# EAGLE design MI_LED_Driver_B (EAGLE 6.5.0)
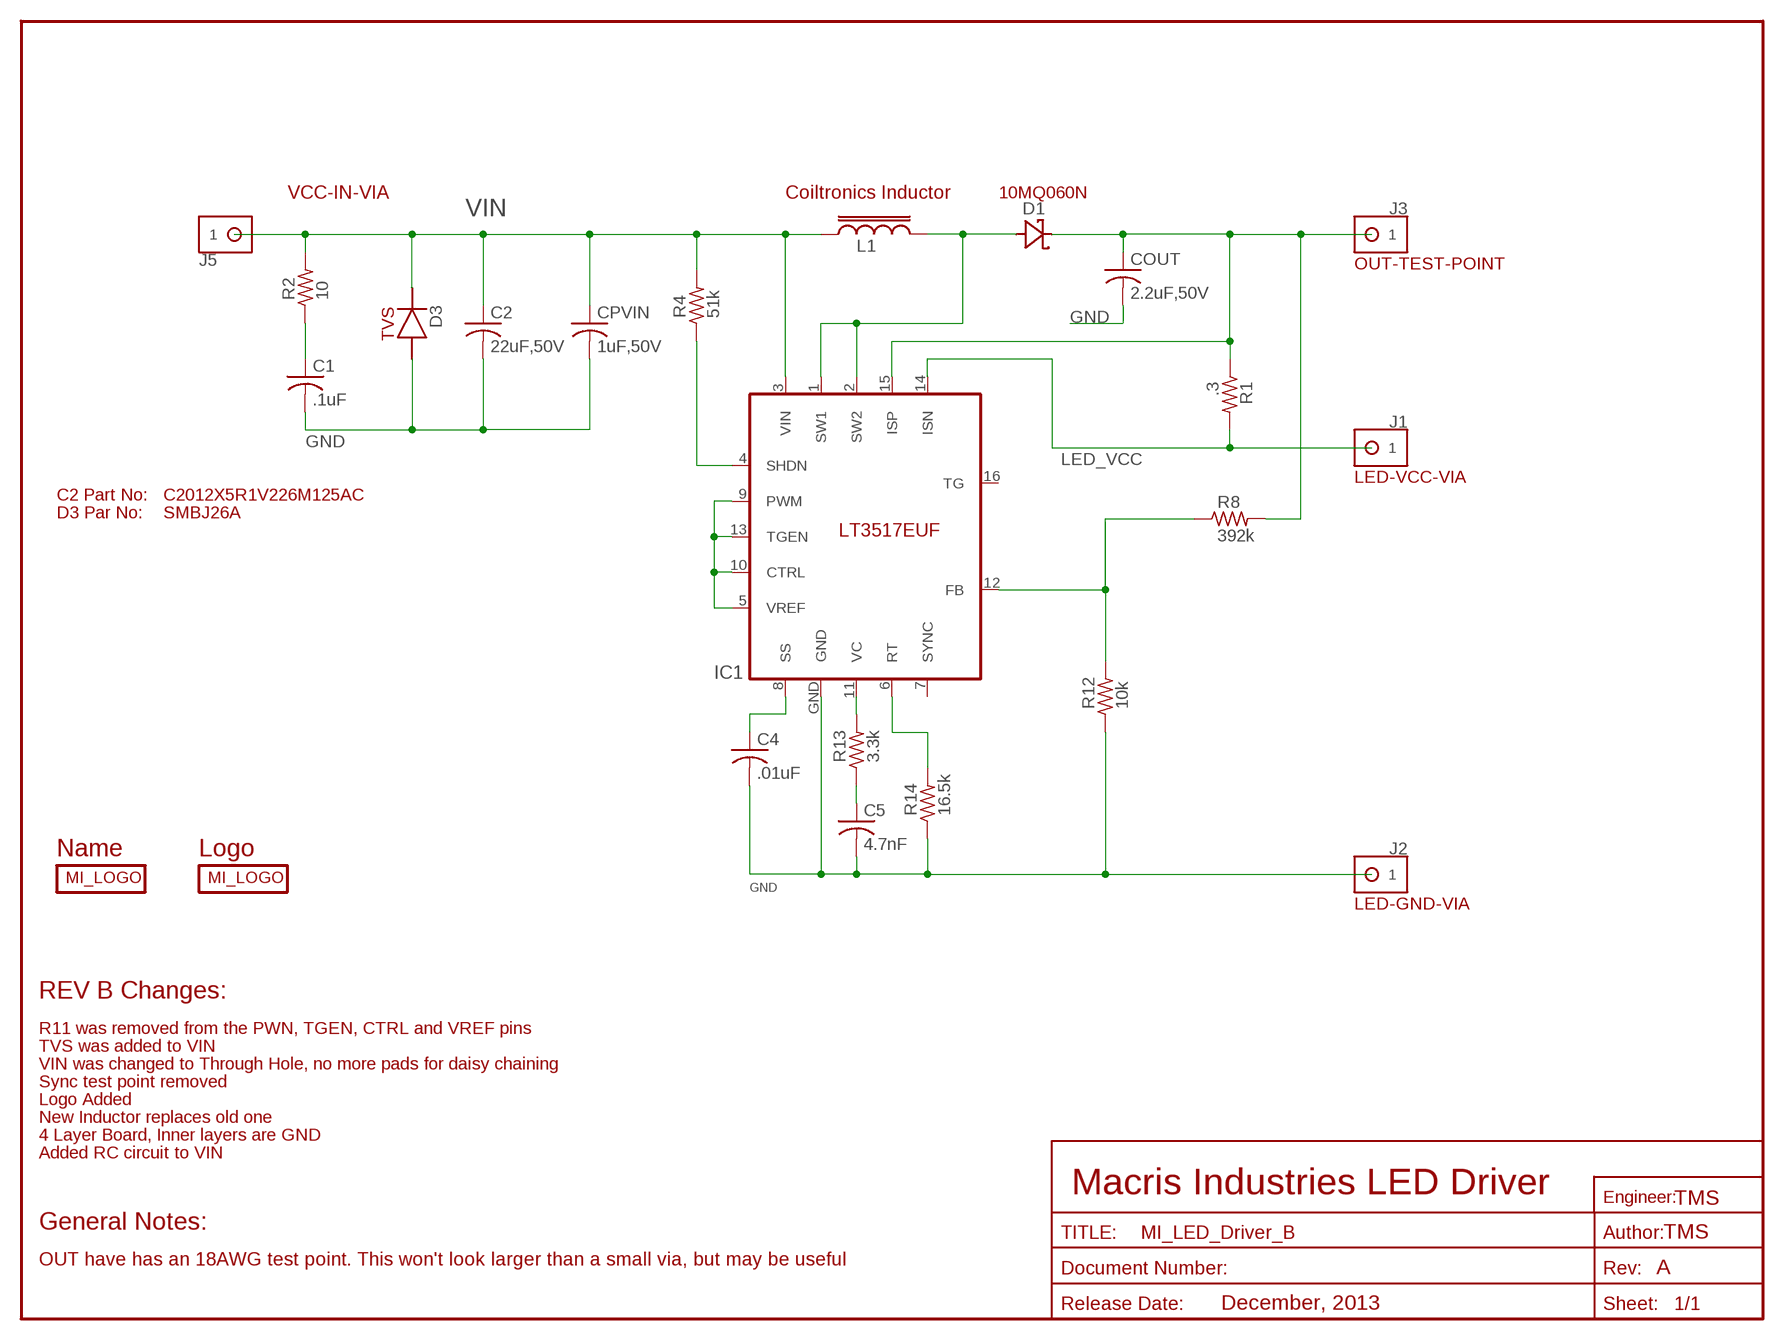
[diagram p0: schematic, sheet 1]

## Parts
C1  .1uF  CAP-S0805  [C0805]
C2  22uF,50V  CAP-S0805  [C0805]
C4  .01uF  CAP-S0805  [C0805]
C5  4.7nF  CAP-S0805  [C0805]
COUT  2.2uF,50V  CAP-S1206  [C1206]
CPVIN  1uF,50V  CAP-S1206  [C1206]
D1  SCHOTTKY-DO-213AC-2  [DO-213AC-2]
D3  DIODE-DO-214AA  [DO-214AA]
IC1  LT3517  [QFN_SM]
J1  HDR-1X1-14AWG  [14AWG-SOLDERPOINT]
J2  HDR-1X1-14AWG  [14AWG-SOLDERPOINT]
J3  HDR-1X1-18AWG_WIRE  [18AWG-SOLDERPOINT]
J5  HDR-1X1-14AWG  [14AWG-SOLDERPOINT]
L1  IND-COILTRONICS-MPI4040  [IND-COILTRONICS]
R1  .3  RES-S1206  [R1206]
R2  10  RES-S0805  [R0805]
R4  51k  RES-S0805  [R0805]
R8  392k  RES-S0805  [R0805]
R12  10k  RES-S0805  [R0805]
R13  3.3k  RES-S0805  [R0805]
R14  16.5k  RES-S0805  [R0805]
U$1  MI_LOGO-NAME_ONE  [MI_LOGO_NAME_1]
U$2  MI_LOGO-ONE  [MI_LOGO]

## Nets
GND: C1.2 C2.2 C4.2 C5.2 COUT.2 CPVIN.2 D3.ANODE(A) IC1.GND J2.P$1 R12.1 R14.1
LED_VCC: IC1.14(ISN) J1.P$1 R1.2
N$1: IC1.4(SHDN) R4.1
N$2: IC1.5(VREF) IC1.9(PWM) IC1.10(CTRL) IC1.13(TGEN)
N$3: C4.1 IC1.8(SS)
N$4: IC1.12(FB) R8.1 R12.2
N$5: D1.A IC1.1(SW1) IC1.2(SW2) L1.NO_DOT
N$6: C5.1 R13.1
N$7: IC1.11(VC) R13.2
N$8: IC1.6(RT) R14.2
N$10: C1.1 R2.1
N$11: COUT.1 D1.C IC1.15(ISP) J3.1 R1.1 R8.2
VIN: C2.1 CPVIN.1 D3.CATH(C) IC1.3(VIN) J5.P$1 L1.DOT R2.2 R4.2
Unconnected: IC1.7(SYNC) IC1.16(TG)

## Notes on the sheet
- VCC-IN-VIA | Coiltronics Inductor | 10MQ060N
- OUT-TEST-POINT
- TVS
- LED-VCC-VIA
- C2 Part No: | C2012X5R1V226M125AC
- D3 Par No: | SMBJ26A
- Name | Logo
- LED-GND-VIA
- REV B Changes:
- R11 was removed from the PWN, TGEN, CTRL and VREF pins
- TVS was added to VIN
- VIN was changed to Through Hole, no more pads for daisy chaining
- Sync test point removed
- Logo Added
- New Inductor replaces old one
- 4 Layer Board, Inner layers are GND
- Added RC circuit to VIN
- Macris Industries LED Driver
- TMS
- General Notes:
- TMS
- OUT have has an 18AWG test point. This won't look larger than a small via, but may be useful
- A
- December, 2013

## Library data of the parts
C1 C2 C4 C5 COUT CPVIN = Discrete:CAP: Capacitor
D1 = Discrete:SCHOTTKY: Generic Schotkey diode
D3 = Discrete:DIODE: Diode
IC1 = IC:LT3517: LT3517 is an LED driver. Digikey Part #LT3517EUF#PBF-ND, Manufacture: Linear Technologies, Man #: LT3517EUF#PBF
J1-J3 J5 = Mechanical:HDR-1X1
L1 = Discrete:IND: Inductors
R1 R2 R4 R8 R12-R14 = Discrete:RES: Resistor
U$1 U$2 = Logo:MI_LOGO

## Board
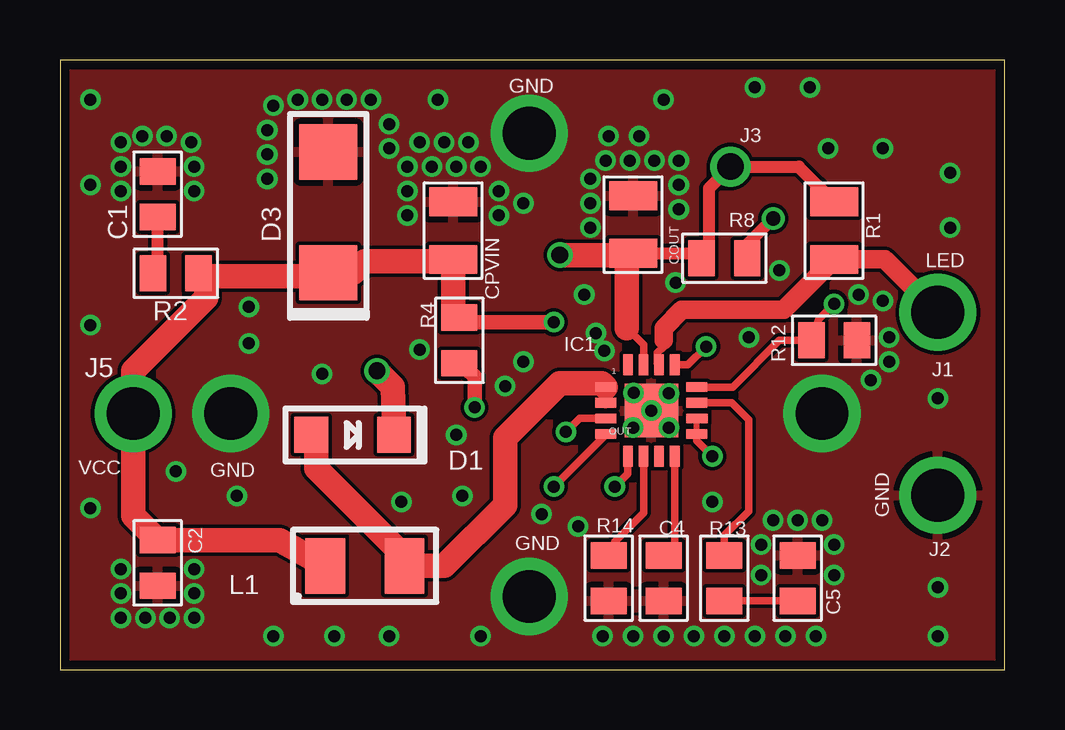
[diagram p1: board, top side]
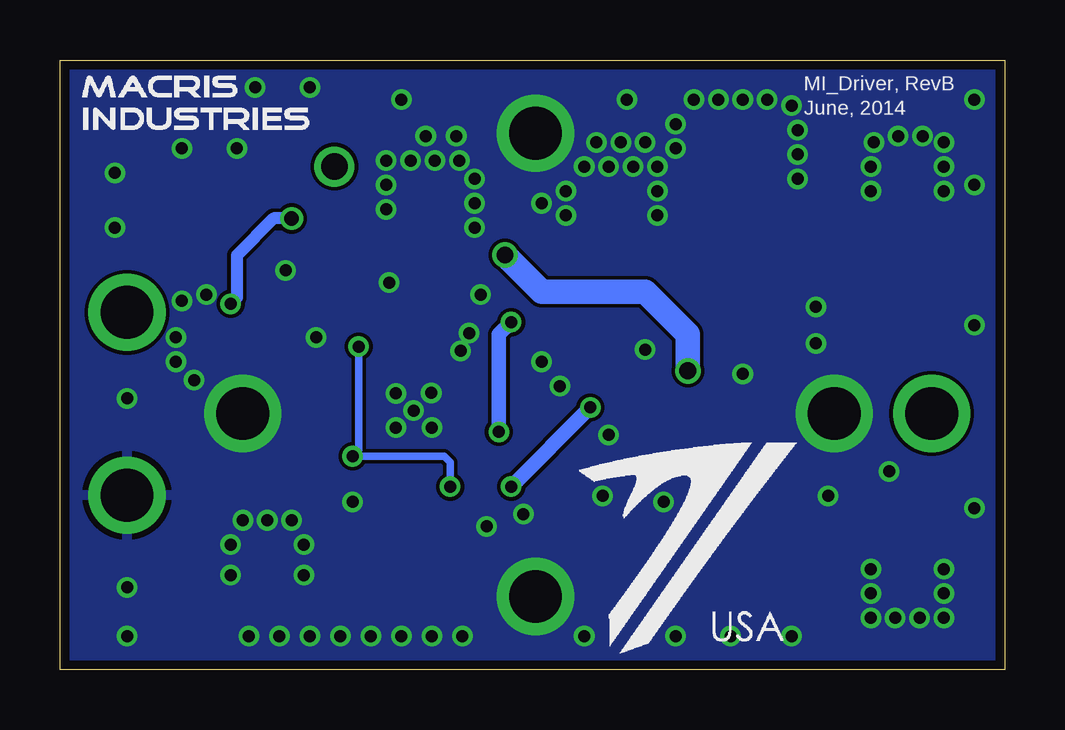
[diagram p2: board, bottom side, seen from below]

Size 39.37 x 25.4 mm. Coordinates in mm from the lower left corner, seen from the top.
Outline: 0,0 39.37,0 39.37,25.4 0,25.4 0,0
Copper layers (1*16): Top 0.0356mm / dielectric 1.5011mm / Bottom 0.0356mm
Design rules "oshPark": minimum track width 6mil, minimum drill 13mil, track to track 6mil, track to pad 6mil, pad to pad 6mil, via to via 6mil, smd to smd 6mil, copper to edge 15mil, drill to drill 6mil, minimum pad ring 7mil, minimum via ring 7mil, stop-mask expansion 4mil, vias tented up to drill 0mil, thermal gap 10mil

### Footprints (pad centres in the part's own frame; a part is rotated, then mirrored left to right if it is on the bottom)
C0805 = smd 1.1 x 1.5: 1 -0.95,0; 2 0.95,0
C1206 = smd 1.2 x 2: 1 -1.2,0; 2 1.2,0
DO-213AC-2 = smd 1.4 x 1.5: A -1.725,0; C 1.725,0
DO-214AA = smd 2.3 x 2.4: ANODE -2.52,0; CATH 2.52,0
QFN_SM = smd 0.87 x 0.4: 1 -1.9,0.975; 2 -1.9,0.325; 3 -1.9,-0.325; 4 -1.9,-0.975; 9 1.9,-0.975; 11 1.9,0.325; 12 1.9,0.975 | smd 0.4 x 0.87: 5 -0.975,-1.9; 6 -0.325,-1.9; 7 0.325,-1.9; 8 0.975,-1.9; 13 0.975,1.9; 14 0.325,1.9; 15 -0.325,1.9; 16 -0.975,1.9 | smd 0.9 x 0.4: 10 1.9,-0.325 | smd 2.225 x 2.225: GND 0,0
14AWG-SOLDERPOINT = drill 2.2: P$1 0,0
18AWG-SOLDERPOINT = drill 1.1 pad 1.676: 1 0,0
IND-COILTRONICS = smd 2.3 x 1.65: DOT 0,1.65; NO_DOT 0,-1.65
R1206 = smd 1.2 x 2: 1 -1.2,0; 2 1.2,0
R0805 = smd 1.1 x 1.5: 1 -0.95,0; 2 0.95,0

### Placement (x,y rotation side)
C1  4.06,19.81 90 top
C2  4.06,4.45 270 top
C4  25.15,3.81 270 top
C5  30.73,3.81 90 top
COUT  23.88,18.54 90 top
CPVIN  16.38,18.29 90 top
D1  12.19,9.78 0 top
D3  11.18,19.05 270 top
IC1  24.64,10.79 0 top
J1  36.58,14.88 0 top
J2  36.58,7.26 0 top
J3  27.94,20.95 0 top
J5  3.05,10.67 0 top
L1  12.7,4.32 90 top
R1  32.26,18.29 270 top
R2  4.83,16.51 0 top
R4  16.64,13.72 90 top
R8  27.69,17.14 180 top
R12  32.26,13.72 180 top
R13  27.69,3.81 90 top
R14  22.86,3.81 90 top
U$1  38.61,22.35 0 bottom
U$2  18.29,0 0 bottom

### Tracks (layer width: path | path; a pad name or v marks a point on that pad's centre or on a via)
GND  (via drill 0.5, 2.2)
  Top 0.254: IC1.GND v23.9,11.53 v25.38,10.08
  other vias: 2.54,19.94 5.46,21.97 2.54,20.95 4.45,22.23 22.68,13.28 23.88,10.08 22.33,14.02 14.48,18.92 16.51,20.95 14.48,20.95 18.29,18.92 14.48,19.94 15.49,20.95 2.54,4.19 2.54,3.17 2.54,2.16 3.56,2.16 4.57,2.16 5.59,2.16 4.83,8.26 5.59,3.17 5.59,4.19 11.43,1.4 8.89,1.4 17.02,21.97 19.3,19.43 16,21.97 14.99,21.97 33.78,12.06 34.54,12.83 22.1,18.41 22.1,19.43 33.27,15.62 34.54,13.84 22.1,20.45 24.13,22.23 22.86,22.23 34.29,15.37 17.53,20.95 18.29,19.94 28.7,13.84 13.72,1.4 23.75,21.21 24.77,21.21 25.78,21.21 25.78,20.19 25.78,19.18 22.73,21.21 7.11,10.67 19.56,3.05 31.75,10.67 19.56,22.35 5.59,20.95 5.59,19.94 3.43,22.23 2.54,21.97 17.53,1.4 22.61,1.4 23.88,1.4 25.15,1.4 26.42,1.4 27.69,1.4 28.96,1.4 30.23,1.4 31.5,1.4 31.75,6.22 29.72,6.22 30.73,6.22 29.21,5.21 32.26,3.94 29.21,3.94 1.27,6.73 1.27,14.35 1.27,20.19 1.27,23.75 8.89,23.5 8.64,20.45 8.64,22.48 9.91,23.75 10.92,23.75 11.94,23.75 12.95,23.75 13.72,22.73 13.72,21.72 8.64,21.46 15.75,23.75 25.15,23.75 28.96,24.26 31.24,24.26 32,21.72 37.08,20.7 37.08,18.41 34.29,21.72 36.58,11.3 36.58,1.4 36.58,3.43 32.26,5.21 27.18,6.99 21.59,5.97 20.07,6.48 25.65,16.13 29.97,16.64 21.84,15.62 19.3,12.83 18.54,11.81 16.76,7.24 14.22,6.99 10.92,12.32 14.99,13.34 7.37,7.24 7.87,15.11 7.87,13.59 16.51,9.78 25.37,11.51 24.64,10.79
  pour Bottom: 0,25.4 39.37,25.4 39.37,0 0,0
  pour Top: 0,25.4 39.37,25.4 39.37,0 0,0
LED_VCC
  Top 0.305: 25.15,13.72 25.15,13.46 24.89,13.21 24.89,12.77 IC1.14
  Top 0.762: J1.P$1 34.37,17.09 R1.2 30.16,14.99 25.91,14.99 25.15,14.22 25.15,13.72
N$1  (via drill 0.5)
  Top 0.305: IC1.4 22.74,9.78 v20.57,7.62
  Top 0.61: v17.27,10.92 17.27,12.23 R4.1
  Bottom 0.61: v17.27,10.92 v20.57,7.62
N$2  (via drill 0.5)
  Top 0.254: IC1.9 IC1.10
  Top 0.305: IC1.9 26.54,9.53 v27.18,8.89 | IC1.13 26.16,12.7 v26.92,13.46 | IC1.5 23.66,8.17 v23.11,7.62
  Bottom 0.305: v26.92,13.46 26.92,9.14 v27.18,8.89 23.37,8.89 23.11,8.64 v23.11,7.62
N$3
  Top 0.305: IC1.8 25.61,4.42 C4.1
N$4  (via drill 0.5, 0.6)
  Top 0.305: IC1.12 28.03,11.77 29.97,13.72 R12.2 31.61,14.59 v32.26,15.24
  Top 0.508: R8.1 28.64,17.71 v29.72,18.8
  Bottom 0.305: v32.26,15.24 32.26,15.49
  Bottom 0.508: v29.72,18.8 30.48,18.8 32,17.27 32,15.49 v32.26,15.24
N$5
  Top 0.508: IC1.1 IC1.2
  Top 1.016: 10.67,9.62 D1.A 10.67,9.58 10.67,8.38 14.73,4.32 | L1.NO_DOT 14.73,4.32 | 14.73,4.32 16,4.32 18.54,6.86 18.54,9.65 20.83,11.94 22.57,11.94 IC1.1
N$6
  Top 0.305: R13.1 C5.1
N$7
  Top 0.305: IC1.11 28,11.12 28.7,10.41 28.7,6.6 27.69,5.59 R13.2
N$8
  Top 0.305: IC1.6 24.31,6.53 23.11,5.33 R14.2
N$10
  Top 0.508: 4.18,18.82 C1.1 4.06,17.02 R2.1
N$11  (via drill 0.7)
  Top 0.305: IC1.15 24.31,13.53 23.62,14.22 | COUT.1 23.62,17.09 | 26.84,17.34 R8.2
  Top 0.508: COUT.1 26.84,17.34 | R1.1 30.79,20.95 J3.1 27.04,20.05 27.04,17.45 R8.2
  Top 0.61: 23.81,17.27 COUT.1
  Top 1.016: 23.62,17.09 23.62,14.22 | D1.C 13.87,11.78 v13.21,12.45 | v20.83,17.27 23.81,17.27
  Bottom 1.016: v13.21,12.45 13.21,13.97 14.99,15.75 19.3,15.75 v20.83,17.27
VIN  (via drill 0.5)
  Top 0.305: IC1.3 21.65,10.47 v21.08,9.91 | R4.2 16.73,14.48
  Top 0.61: 16.73,14.48 v20.57,14.48
  Top 1.016: L1.DOT 9.15,5.39 C2.1 3.05,6.41 J5.P$1 3.05,12.45 6.1,15.49 6.1,16.19 R2.2 6.1,16.4 10.67,16.4 D3.CATH | 11.06,17.02 D3.CATH | 16.2,16.9 CPVIN.1 | CPVIN.1 16.38,14.82 R4.2 | D3.CATH 12.21,16.53 12.7,17.02 16.31,17.02 CPVIN.1
  Bottom 0.61: v21.08,9.91 21.08,13.97 v20.57,14.48

### Text on the board
tNames: GND | LED | OUT | GND | VCC | GND | GND
bNames: MI_Driver, RevB | June, 2014
Document: 1.55" | .120" | .414" | 1" | .3" | .420" | .120" | .286" | .120" | .3" | .280" | .770"